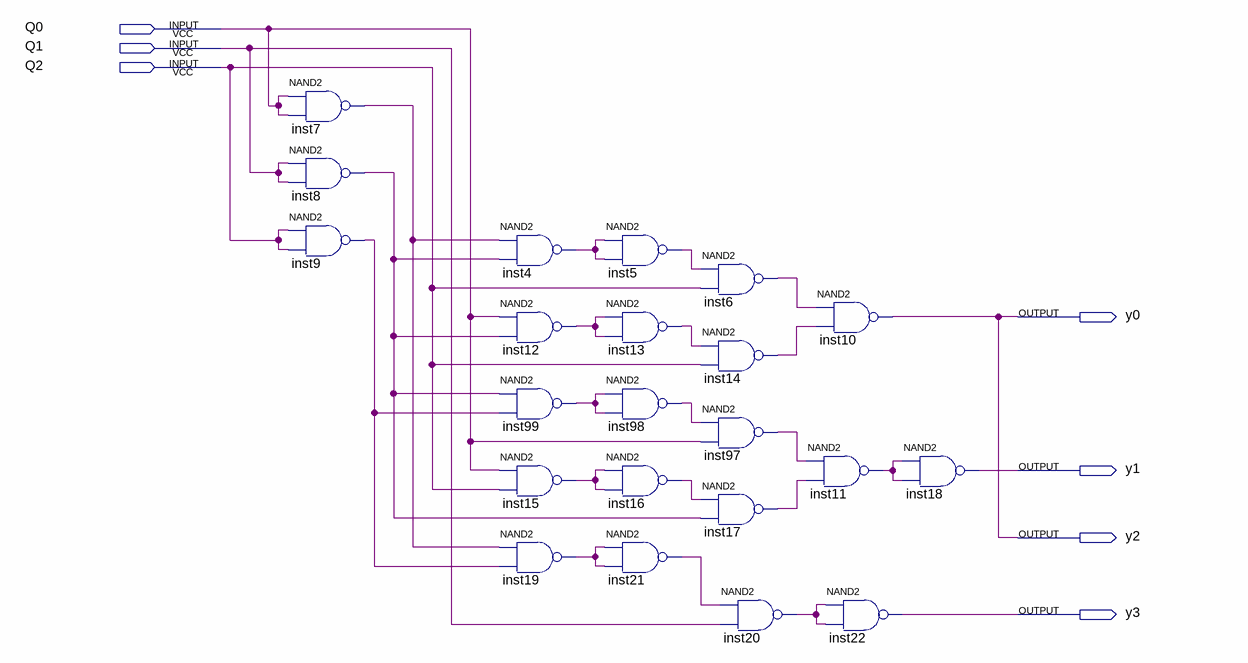
[diagram p0: schematic sheet]
// Quartus schematic recoder_schema.bdf as structural Verilog: 22 symbols, 7 pins
module recoder_schema (
  input  Q0,
  input  Q1,
  input  Q2,
  output y0,
  output y1,
  output y2,
  output y3
);

  wire inst4_out, inst5_out, inst6_out, inst7_out, inst8_out, inst9_out, inst11_out, inst12_out, inst13_out,
       inst14_out, inst15_out, inst16_out, inst17_out, inst19_out, inst20_out, inst21_out, inst97_out,
       inst98_out, inst99_out;

  nand inst7 (inst7_out, Q0, Q0);
  nand inst8 (inst8_out, Q1, Q1);
  nand inst9 (inst9_out, Q2, Q2);
  nand inst4 (inst4_out, inst7_out, inst8_out);
  nand inst12 (inst12_out, Q0, inst8_out);
  nand inst99 (inst99_out, inst8_out, inst9_out);
  nand inst15 (inst15_out, Q0, Q2);
  nand inst19 (inst19_out, inst7_out, inst9_out);
  nand inst5 (inst5_out, inst4_out, inst4_out);
  nand inst13 (inst13_out, inst12_out, inst12_out);
  nand inst98 (inst98_out, inst99_out, inst99_out);
  nand inst16 (inst16_out, inst15_out, inst15_out);
  nand inst21 (inst21_out, inst19_out, inst19_out);
  nand inst6 (inst6_out, inst5_out, Q2);
  nand inst14 (inst14_out, inst13_out, Q2);
  nand inst97 (inst97_out, inst98_out, Q0);
  nand inst17 (inst17_out, inst16_out, inst8_out);
  nand inst20 (inst20_out, inst21_out, Q1);
  nand inst10 (y0, inst6_out, inst14_out);
  nand inst11 (inst11_out, inst97_out, inst17_out);
  nand inst22 (y3, inst20_out, inst20_out);
  nand inst18 (y1, inst11_out, inst11_out);

  assign y2 = y0;
endmodule
